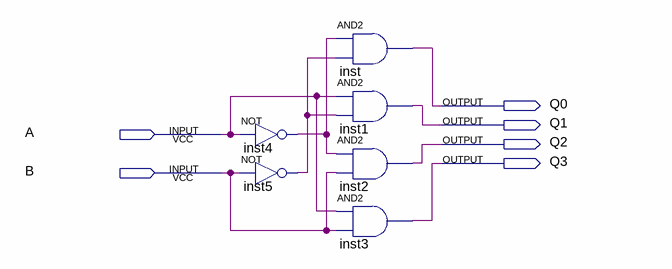
[diagram p0: schematic sheet]
// Quartus schematic 2_4decoder.bdf as structural Verilog: 6 symbols, 6 pins
module \2_4decoder  (
  input  A,
  input  B,
  output Q0,
  output Q1,
  output Q2,
  output Q3
);

  wire inst4_out, inst5_out;

  not inst4 (inst4_out, A);
  not inst5 (inst5_out, B);
  and inst (Q0, inst4_out, inst5_out);
  and inst1 (Q1, A, inst5_out);
  and inst2 (Q2, inst4_out, B);
  and inst3 (Q3, A, B);
endmodule
